# EAGLE design Prommer nano v2 (EAGLE 9.4.2)
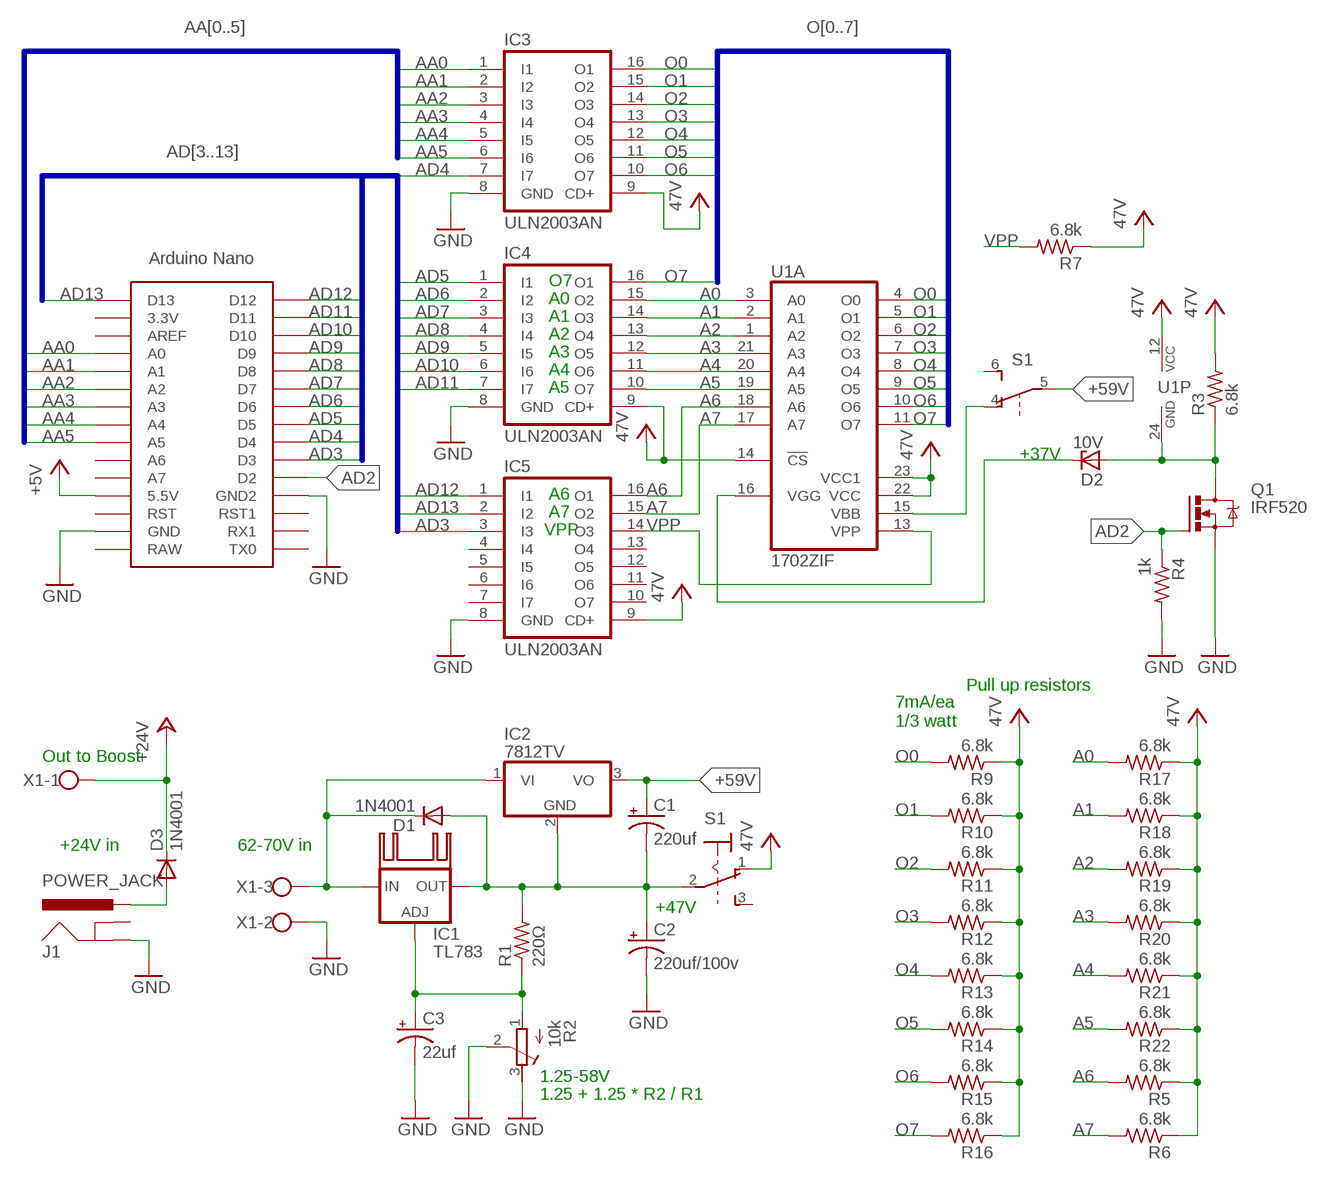
[diagram p0: schematic, sheet 1]

## Parts
C1  220uf  CPOL-USE5-10.5  [E5-10,5]
C2  220uf/100v  CPOL-USE5-13  [E5-13]
C3  22uf  CPOL-USE5-10.5  [E5-10,5]
D1  1N4001  DIODE-D-7.5  [D-7.5]
D2  10V  ZENER-DIODEDO34-7  [DO34Z7]
D3  1N4001  DIODE-D-7.5  [D-7.5]
IC1  TL783  LM317TS  [317TS]
IC2  7812TV  [TO220V]
IC3  ULN2003AN  [DIL16]
IC4  ULN2003AN  [DIL16]
IC5  ULN2003AN  [DIL16]
J1  POWER_JACK  [POWER_JACK_PTH]
KK1  SK95-2M3  [SK95-2M3]
Q1  IRF520  [TO220BV]
R1  220Ω  R-US_0207/10  [0207/10]
R2  10k  R-TRIMM64W  [RTRIM64W]
R3  6.8k  R-US_0207/10  [0207/10]
R4  1k  R-US_0207/10  [0207/10]
R5  6.8k  R-US_0207/10  [0207/10]
R6  6.8k  R-US_0207/10  [0207/10]
R7  6.8k  R-US_0207/10  [0207/10]
R9  6.8k  R-US_0207/10  [0207/10]
R10  6.8k  R-US_0207/10  [0207/10]
R11  6.8k  R-US_0207/10  [0207/10]
R12  6.8k  R-US_0207/10  [0207/10]
R13  6.8k  R-US_0207/10  [0207/10]
R14  6.8k  R-US_0207/10  [0207/10]
R15  6.8k  R-US_0207/10  [0207/10]
R16  6.8k  R-US_0207/10  [0207/10]
R17  6.8k  R-US_0207/10  [0207/10]
R18  6.8k  R-US_0207/10  [0207/10]
R19  6.8k  R-US_0207/10  [0207/10]
R20  6.8k  R-US_0207/10  [0207/10]
R21  6.8k  R-US_0207/10  [0207/10]
R22  6.8k  R-US_0207/10  [0207/10]
S1  320-938  [320-938]
U1  1702ZIF  [ZIF24]
U$1  NANO  [NANO]
X1  W237-103  [W237-103]

## Nets
+5V [power]: U$1.5V(5.5V)
+24V [power]: D3.C X1.1
+47V [power]: IC3.9(CD+) IC4.9(CD+) IC5.9(CD+) R3.2 R5.1 R6.1 R7.1 R9.1 R10.1 R11.1 R12.1 R13.1 R14.1 R15.1 R16.1 R17.1 R18.1 R19.1 R20.1 R21.1 R22.1 S1.1(1:O) U1.12(P:VCC) U1.14(A:!CS) U1.22(A:VCC) U1.23(A:VCC1) ; supply symbol labelled 47V
+59V [power]: C1.+ IC2.3(VO) S1.5(B:P)
A0: IC4.15(O2) R17.2 U1.3(A:A0)
A1: IC4.14(O3) R18.2 U1.2(A:A1)
A2: IC4.13(O4) R19.2 U1.1(A:A2)
A3: IC4.12(O5) R20.2 U1.21(A:A3)
A4: IC4.11(O6) R21.2 U1.20(A:A4)
A5: IC4.10(O7) R22.2 U1.19(A:A5)
A6: IC5.16(O1) R5.2 U1.18(A:A6)
A7: IC5.15(O2) R6.2 U1.17(A:A7)
AA0: IC3.1(I1) U$1.A0
AA1: IC3.2(I2) U$1.A1
AA2: IC3.3(I3) U$1.A2
AA3: IC3.4(I4) U$1.A3
AA4: IC3.5(I5) U$1.A4
AA5: IC3.6(I6) U$1.A5
AD2: Q1.G R4.1 U$1.D2
AD3: IC5.3(I3) U$1.D3
AD4: IC3.7(I7) U$1.D4
AD5: IC4.1(I1) U$1.D5
AD6: IC4.2(I2) U$1.D6
AD7: IC4.3(I3) U$1.D7
AD8: IC4.4(I4) U$1.D8
AD9: IC4.5(I5) U$1.D9
AD10: IC4.6(I6) U$1.D10
AD11: IC4.7(I7) U$1.D11
AD12: IC5.1(I1) U$1.D12
AD13: IC5.2(I2) U$1.D13
GND [power]: C2.- C3.- IC3.8(GND) IC4.8(GND) IC5.8(GND) J1.GND Q1.S R2.2(S) R2.3(E) R4.2 U$1.GND U$1.GND1(GND2) X1.2
N$1 [power]: D1.C IC1.3(IN) IC2.1(VI) X1.3
N$3 [power]: C3.+ IC1.1(ADJ) R1.1 R2.1(A)
N$12: D2.C U1.16(A:VGG)
N$13 [power]: D2.A Q1.D R3.1 U1.24(P:GND)
N$14 [power]: C1.- C2.+ D1.A IC1.2(OUT) IC2.2(GND) R1.2 S1.2(1:P)
N$16 [power]: D3.A J1.PWR
N$33 [power]: S1.4(B:O) U1.15(A:VBB)
O0: IC3.16(O1) R9.2 U1.4(A:O0)
O1: IC3.15(O2) R10.2 U1.5(A:O1)
O2: IC3.14(O3) R11.2 U1.6(A:O2)
O3: IC3.13(O4) R12.2 U1.7(A:O3)
O4: IC3.12(O5) R13.2 U1.8(A:O4)
O5: IC3.11(O6) R14.2 U1.9(A:O5)
O6: IC3.10(O7) R15.2 U1.10(A:O6)
O7: IC4.16(O1) R16.2 U1.11(A:O7)
VPP: IC5.14(O3) R7.2 U1.13(A:VPP)
Unconnected: IC5.4(I4) IC5.5(I5) IC5.6(I6) IC5.7(I7) IC5.10(O7) IC5.11(O6) IC5.12(O5) IC5.13(O4) J1.GNDBREAK S1.3(1:S) S1.6(B:S) U$1.3.3V U$1.A6 U$1.A7 U$1.AREF U$1.RAW U$1.RST U$1.RST1 U$1.RX1 U$1.TX0

## Buses
O[0..7]
AA[0..5]
AD[3..13]

## Notes on the sheet
- O7
- A0
- A1
- A2
- A3
- A4
- A5
- +37V
- A6
- A7
- VPP
- Pull up resistors
- 7mA/ea
  1/3 watt
- Out to Boost
- +24V in | 62-70V in
- +47V
- 1.25-58V
- 1.25 + 1.25 * R2 / R1

## Library data of the parts
C1-C3 = rcl:CPOL-US: POLARIZED CAPACITOR, American symbol
D1 D3 = diode:DIODE-: DIODE
D2 = diode:ZENER-DIODE: Z-Diode
IC1 = v-reg:LM317TS: VOLTAGE REGULATOR
IC2 = linear:78*: Positive VOLTAGE REGULATOR Source: http://cache.national.com/ds/LM/LM78L05.pdf http://www.fairchildsemi.com/ds/LM/LM7805.pdf
IC3-IC5 = uln-udn:ULN2003A: DRIVER ARRAY
J1 = SparkFun-Connectors:POWER_JACK: Power Jack Connector This is the standard 5.5mm barrel jack for power. The PTH is the most common, proven, reliable, footprint. The Slot footprint only works if the mill layer is transmitted to the PCB fab house so be warned. Here are the connectors we sell at SparkFun: DC Barrel Power Jack/Connector <https://www.sparkfun.com/products/119> (PRT-00119) DC Barrel Power Jack/Connector (SMD) <https://www.sparkfun.com/products/12748> (PRT-12748) DC Barrel Jack Adapter - Breadboard Compatible <https://www.sparkfun.com/products/10811> (PRT-10811) It is used on this SparkFun product (and many, many others): SparkFun RedBoard - Programmed with Arduino <https://www.sparkfun.com/products/12757> (DEV-12757) Also, if you need a mating power supply or connector, please check these out: Wall Adapter Power Supply - 9VDC 650mA <https://www.sparkfun.com/products/298> (TOL-00298) DC Barrel Jack Adapter - Male <https://www.sparkfun.com/products/10287> (PRT-10287); PROD_ID: CONN-08197
KK1 = heatsink:SK95-2M3: HEATSINK manufacturer Fischer/distributor Buerklin
Q1 = transistor-power:IRF520: HEXFET Power MOSFET
R1 R3-R7 R9-R22 = rcl:R-US_: RESISTOR, American symbol
R2 = rcl:R-TRIMM: Trimm resistor
S1 = switch:320-938: TOGGLE SWITCH distributor RS Components
U1 = memory:1702
U$1 = Arduino-clone:NANO: Arduino Nano
X1 = con-wago-500:W237-103: WAGO SCREW CLAMP; MPN: 237-103; OC_FARNELL: unknown; OC_NEWARK: 18M7116

## Net classes
1 power: width 0.762 mm

## Board
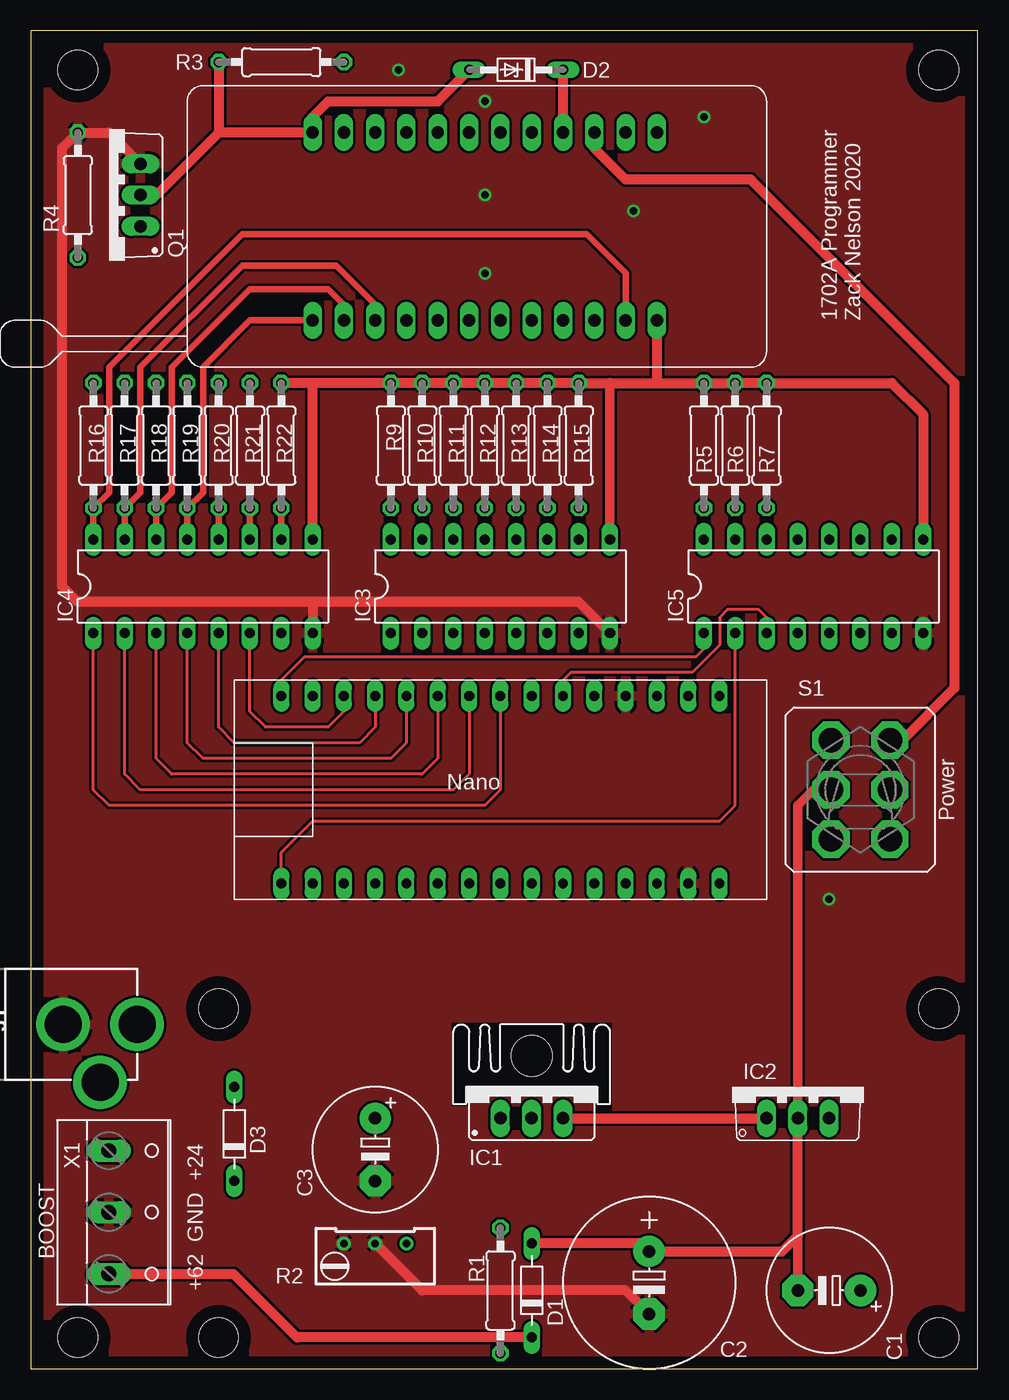
[diagram p1: board, top side]
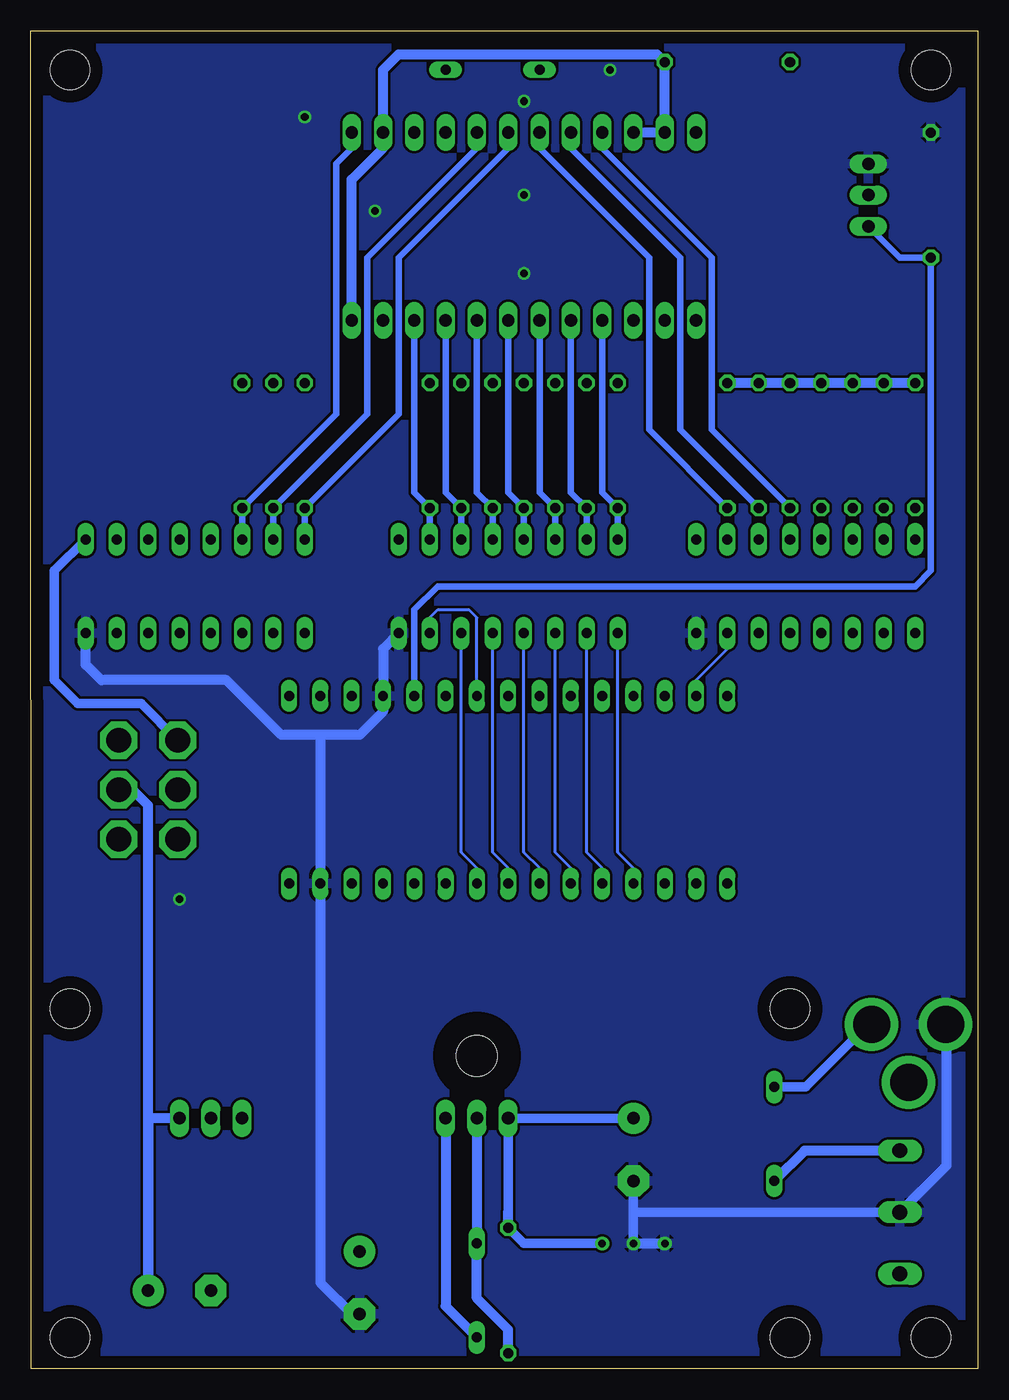
[diagram p2: board, bottom side, seen from below]

Size 76.83 x 108.58 mm. Coordinates in mm from the lower left corner, seen from the top.
Outline: 0,0 76.81,0 76.83,108.58 0,108.58 0,0
Copper layers (1*16): Top 0.035mm / dielectric 1.5mm / Bottom 0.035mm
Design rules "default": minimum track width 10mil, minimum drill 24mil, track to track 8mil, track to pad 8mil, pad to pad 8mil, via to via 8mil, smd to smd 8mil, copper to edge 40mil, drill to drill 8mil, minimum pad ring 10mil, minimum via ring 8mil, stop-mask expansion 4mil, vias tented up to drill 0mil, thermal gap 10mil
Holes 3.2 mm at 3.81,2.54 73.66,2.54 3.81,105.41 73.66,105.41 15.24,29.21 15.24,2.54 73.66,29.21

### Footprints (pad centres in the part's own frame; a part is rotated, then mirrored left to right if it is on the bottom)
E5-10,5 = drill 1.016 pad 2.54: + -2.54,0 | drill 1.016 pad 2.54 octagon: - 2.54,0
E5-13 = drill 1.016 pad 2.54: + -2.54,0 | drill 1.016 pad 2.54 octagon: - 2.54,0
D-7.5 = drill 0.813 long: A 3.81,0; C -3.81,0
DO34Z7 = drill 0.813 long: A 3.81,0; C -3.81,0
317TS = drill 1.016 long: 1 -2.54,-2.54; 2 0,-2.54; 3 2.54,-2.54
TO220V = drill 1.016 long: 1 -2.54,-2.54; 2 0,-2.54; 3 2.54,-2.54
DIL16 = drill 0.813 long: 1 -8.89,-3.81; 2 -6.35,-3.81; 3 -3.81,-3.81; 4 -1.27,-3.81; 5 1.27,-3.81; 6 3.81,-3.81; 7 6.35,-3.81; 8 8.89,-3.81; 9 8.89,3.81; 10 6.35,3.81; 11 3.81,3.81; 12 1.27,3.81; 13 -1.27,3.81; 14 -3.81,3.81; 15 -6.35,3.81; 16 -8.89,3.81
POWER_JACK_PTH = drill 2.997 pad 4.318: GND 0,7.7; GNDBREAK 4.7,10.7; PWR 0,13.7
SK95-2M3 = hole 3.302: 0,2.54
TO220BV = drill 1.016 long: D 0,-2.54; G -2.54,-2.54; S 2.54,-2.54
0207/10 = drill 0.813 octagon: 1 -5.08,0; 2 5.08,0
RTRIM64W = drill 0.61: 1 1.27,-2.54; 2 1.27,0; 3 1.27,2.54
320-938 = drill 2.007 octagon: 1 -2.388,4.013; 2 -2.388,0; 3 -2.388,-4.013; 4 2.388,4.013; 5 2.388,0; 6 2.388,-4.013
ZIF24 = drill 1 long: 1 -13.97,-7.62; 2 -11.43,-7.62; 3 -8.89,-7.62; 4 -6.35,-7.62; 5 -3.81,-7.62; 6 -1.27,-7.62; 7 1.27,-7.62; 8 3.81,-7.62; 9 6.35,-7.62; 10 8.89,-7.62; 11 11.43,-7.62; 12 13.97,-7.62; 13 13.97,7.62; 14 11.43,7.62; 15 8.89,7.62; 16 6.35,7.62; 17 3.81,7.62; 18 1.27,7.62; 19 -1.27,7.62; 20 -3.81,7.62; 21 -6.35,7.62; 22 -8.89,7.62; 23 -11.43,7.62; 24 -13.97,7.62
NANO = drill 0.8 long: 3.3V -7.62,13.97; 5V -7.62,-11.43; A0 -7.62,8.89; A1 -7.62,6.35; A2 -7.62,3.81; A3 -7.62,1.27; A4 -7.62,-1.27; A5 -7.62,-3.81; A6 -7.62,-6.35; A7 -7.62,-8.89; AREF -7.62,11.43; D2 7.62,-8.89; D3 7.62,-6.35; D4 7.62,-3.81; D5 7.62,-1.27; D6 7.62,1.27; D7 7.62,3.81; D8 7.62,6.35; D9 7.62,8.89; D10 7.62,11.43; D11 7.62,13.97; D12 7.62,16.51; D13 -7.62,16.51; GND -7.62,-16.51; GND1 7.62,-11.43; RAW -7.62,-19.05; RST -7.62,-13.97; RST1 7.62,-13.97; RX1 7.62,-16.51; TX0 7.62,-19.05
W237-103 = drill 1.194 long: 1 -5,-1.29; 2 0,-1.29; 3 5,-1.29

### Placement (x,y rotation side)
C1  64.77,6.35 180 top
C2  50.16,6.99 270 top
C3  27.94,17.78 270 top
D1  40.64,6.35 90 top
D2  39.37,105.41 180 top
D3  16.51,19.05 90 top
IC1  40.64,22.86 0 top
IC2  62.23,22.86 0 top
IC3  38.1,63.5 0 top
IC4  13.97,63.5 0 top
IC5  63.5,63.5 0 top
J1  -5.08,27.94 270 top
KK1  40.64,22.86 0 top
Q1  6.35,95.25 90 top
R1  38.1,6.35 270 top
R2  27.94,8.89 90 top
R3  20.32,106.05 0 top
R4  3.81,95.25 90 top
R5  54.61,74.93 270 top
R6  57.15,74.93 270 top
R7  59.69,74.93 270 top
R9  29.21,74.93 270 top
R10  31.75,74.93 270 top
R11  34.29,74.93 270 top
R12  36.83,74.93 270 top
R13  39.37,74.93 270 top
R14  41.91,74.93 270 top
R15  44.45,74.93 270 top
R16  5.08,74.93 270 top
R17  7.62,74.93 270 top
R18  10.16,74.93 270 top
R19  12.7,74.93 270 top
R20  15.24,74.93 270 top
R21  17.78,74.93 270 top
R22  20.32,74.93 270 top
S1  67.31,46.99 0 top
U1  36.83,92.71 0 top
U$1  36.83,46.99 90 top
X1  7.62,12.7 270 top

### Tracks (layer width: path | path; a pad name or v marks a point on that pad's centre or on a via)
+24V
  Bottom 0.813: X1.1 14.05,17.7 D3.C
+47V
  Top 0.762: IC3.9 46.99,80.01
  Top 0.813: 22.86,80.01 R9.1 R10.1 R11.1 R12.1 R13.1 R14.1 R15.1 46.99,80.01 50.8,80.01 | 22.86,80.01 R22.1 | 50.8,80.01 R5.1 R6.1 R7.1 69.85,80.01 72.39,77.47 IC5.9 | U1.12 50.8,80.01 | IC4.9 22.86,80.01
  Bottom 0.762: S1.1 67.89,53.98 73.03,53.98 74.93,55.88 74.93,64.77 IC5.9
  Bottom 0.813: U1.12 50.8,96.52 48.26,99.06 U1.14 48.26,105.41 46.99,106.68 26.04,106.68 R3.2 U1.23 U1.22 | R16.1 R17.1 R18.1 R19.1 R20.1 R21.1 R22.1
+59V
  Bottom 0.813: IC2.3 67.31,20.32 C1.+ 67.31,45.72 68.58,46.99 S1.5
A0
  Top 0.508: IC4.15 R17.2 8.89,71.12 8.89,81.28 17.14,89.53 24.77,89.53 27.94,86.36 U1.3
A1
  Top 0.508: IC4.14 R18.2 11.43,71.12 11.43,81.28 17.78,87.63 24.13,87.63 25.4,86.36 U1.2
A2
  Top 0.508: IC4.13 R19.2 13.97,71.12 13.97,81.28 17.78,85.09 U1.1
A3
  Top 0.508: IC4.12 R20.2
  Bottom 0.508: R20.2 21.59,76.2 21.59,90.17 30.48,99.06 U1.21
A4
  Top 0.508: IC4.11 R21.2
  Bottom 0.508: R21.2 24.13,76.2 24.13,90.17 33.02,99.06 U1.20
A5
  Top 0.508: IC4.10 R22.2
  Bottom 0.508: U1.19 35.56,99.06 26.67,90.17 26.67,76.2 R22.2
A6
  Bottom 0.508: IC5.16 R5.2 46.99,77.47 46.99,90.17 38.1,99.06 U1.18
A7
  Bottom 0.508: IC5.15 R6.2 49.53,77.47 49.53,90.17 40.64,99.06 U1.17
AA0
  Bottom 0.254: U$1.A0 27.94,40.64 29.21,41.91 IC3.1
AA1
  Bottom 0.254: U$1.A1 30.48,40.64 31.75,41.91 IC3.2
AA2
  Bottom 0.254: U$1.A2 33.02,40.64 34.29,41.91 IC3.3
AA3
  Bottom 0.254: U$1.A3 35.56,40.64 36.83,41.91 IC3.4
AA4
  Bottom 0.254: U$1.A4 38.1,40.64 39.37,41.91 IC3.5
AA5
  Bottom 0.254: U$1.A5 40.64,40.64 41.91,41.91 IC3.6
AD2
  Bottom 0.508: Q1.G 6.35,90.17 R4.1 3.81,64.77 5.08,63.5 43.81,63.5 45.72,61.59 U$1.D2
AD3
  Top 0.254: U$1.D3 43.18,55.88 43.81,56.52 53.66,56.52 55.88,58.74 55.88,60.96 56.52,61.59 59.05,61.59 59.69,60.96 IC5.3
AD4
  Bottom 0.254: U$1.D4 40.64,60.96 41.27,61.59 41.32,61.59 43.81,61.59 44.45,60.96 IC3.7
AD5
  Top 0.254: U$1.D5 38.1,46.99 36.83,45.72 6.35,45.72 5.08,46.99 IC4.1
AD6
  Top 0.254: U$1.D6 35.56,48.26 34.29,46.99 8.89,46.99 7.62,48.26 IC4.2
AD7
  Top 0.254: U$1.D7 33.02,49.53 31.75,48.26 11.43,48.26 10.16,49.53 IC4.3
AD8
  Top 0.254: U$1.D8 30.48,50.8 29.21,49.53 13.97,49.53 12.7,50.8 IC4.4
AD9
  Top 0.254: U$1.D9 27.94,52.07 26.67,50.8 16.51,50.8 15.24,52.07 IC4.5
AD10
  Top 0.254: U$1.D10 25.4,53.34 24.13,52.07 19.05,52.07 17.78,53.34 IC4.6
AD11
  Bottom 0.254: IC4.7 20.32,58.42 22.86,55.88 U$1.D11
AD12
  Top 0.254: U$1.D12 20.32,55.88 22.23,57.78 53.98,57.78 54.61,58.42 IC5.1
AD13
  Top 0.254: U$1.D13 20.32,41.91 22.86,44.45 55.88,44.45 57.15,45.72 IC5.2
GND  (via drill 0.61)
  Top 0.813: 22.86,62.23 IC4.8 | 22.86,62.23 44.45,62.23 IC3.8 | 22.86,62.23 3.81,62.23 2.54,63.5 2.54,99.06 R4.2 6.35,100.33 Q1.S | R2.2 31.75,6.35 48.26,6.35 C2.-
  Bottom 0.508: 2.54,27.86 J1.GND
  Bottom 0.762: C3.- 27.94,12.7 | 27.94,12.7 R2.2 | X1.2 27.94,12.7
  Bottom 0.813: R2.2 R2.3 | 53.34,51.44 U$1.GND 53.34,6.99 50.8,4.45 C2.- | 53.34,51.44 50.16,51.44 48.26,53.34 U$1.GND1 48.26,58.42 IC3.8 | IC5.8 72.39,57.15 71.12,55.88 60.96,55.88 56.52,51.44 53.34,51.44 | 2.54,27.86 2.54,16.49 X1.2
  other vias: 36.83,95.25 36.83,88.9 48.9,93.98 64.77,38.1 36.83,102.87 29.84,105.41 54.61,101.6
  pour Top: 0,0 0,109.22 76.2,109.22 77.47,107.95 77.47,0
  pour Bottom: 0,0 0,109.22 77.47,109.22 77.47,0
N$1
  Top 0.813: IC1.3 IC2.1 | D1.C 21.59,2.54 16.43,7.7 X1.3
  Bottom 0.813: D1.C 43.18,5.08 IC1.3
N$3
  Bottom 0.762: C3.+ IC1.1 R1.1 36.83,10.16 R2.1
  Bottom 0.813: R1.1 38.1,12.7
N$12
  Top 0.813: U1.16 D2.C
N$13
  Top 0.813: D2.A 33.02,102.87 24.13,102.87 22.86,101.6 U1.24 15.24,100.33 | R3.1 15.24,100.33 | 15.24,100.33 10.16,95.25 Q1.D
N$14
  Top 0.762: S1.2 63.5,46.99 62.23,45.72 IC2.2 | C1.- 62.23,10.79
  Top 0.813: D1.A 49.53,10.16 C2.+ 60.96,9.53 62.23,10.79 IC2.2
  Bottom 0.813: R1.2 38.1,3.17 40.64,5.71 D1.A IC1.2
N$16
  Bottom 0.762: D3.A 13.97,22.86 8.89,27.94 J1.PWR
N$33
  Top 0.762: S1.4 70.69,51
  Top 0.813: U1.15 45.72,99.06 48.26,96.52 58.42,96.52 74.93,80.01 74.93,55.24 70.69,51
O0
  Bottom 0.508: IC3.16 R9.2 30.48,71.12 U1.4
O1
  Bottom 0.508: IC3.15 R10.2 33.02,71.12 U1.5
O2
  Bottom 0.508: IC3.14 R11.2 35.56,71.12 U1.6
O3
  Bottom 0.508: IC3.13 R12.2 38.1,71.12 U1.7
O4
  Bottom 0.508: IC3.12 R13.2 40.64,71.12 U1.8
O5
  Bottom 0.508: IC3.11 R14.2 43.18,71.12 U1.9
O6
  Bottom 0.508: IC3.10 R15.2 45.72,71.12 U1.10
O7
  Top 0.508: IC4.16 R16.2 6.35,71.12 6.35,81.28 17.14,92.08 45.09,92.08 48.26,88.9 U1.11
VPP
  Bottom 0.508: IC5.14 R7.2 52.07,77.47 52.07,97.79 50.8,99.06 U1.13

### Text on the board
tNames: 1702A Programmer / Zack Nelson 2020 | Power | BOOST | +62 GND +24